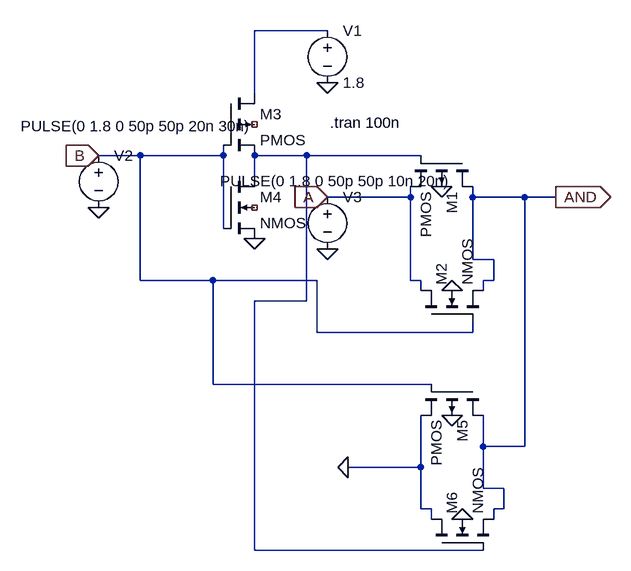
[diagram p0: schematic AND.asc]
AND.asc, the LTspice schematic file:
Version 4.1
SHEET 1 880 712
WIRE 64 -96 -48 -96
WIRE -48 0 -48 -96
WIRE -224 96 -288 96
WIRE -96 96 -96 80
WIRE -96 96 -224 96
WIRE 32 96 -48 96
WIRE 208 96 32 96
WIRE -48 128 -48 96
WIRE 192 160 192 144
WIRE 192 160 64 160
WIRE 288 160 288 144
WIRE 368 160 288 160
WIRE 416 160 368 160
WIRE -96 208 -96 96
WIRE 288 256 288 160
WIRE 320 256 288 256
WIRE -224 288 -224 96
WIRE -112 288 -224 288
WIRE 48 288 -112 288
WIRE 192 288 192 160
WIRE 208 288 192 288
WIRE 320 288 320 256
WIRE 320 288 304 288
WIRE 208 304 208 288
WIRE 304 304 304 288
WIRE 32 320 32 96
WIRE 32 320 -48 320
WIRE 48 368 48 288
WIRE 288 368 288 352
WIRE 288 368 48 368
WIRE -112 448 -112 288
WIRE 224 448 -112 448
WIRE 304 544 304 496
WIRE 368 544 368 160
WIRE 368 544 304 544
WIRE 208 576 208 496
WIRE 208 576 96 576
WIRE 304 608 304 544
WIRE 336 608 304 608
WIRE 208 640 208 576
WIRE 224 640 208 640
WIRE 336 640 336 608
WIRE 336 640 320 640
WIRE 224 656 224 640
WIRE 320 656 320 640
WIRE -48 704 -48 320
WIRE 304 704 -48 704
FLAG 64 -16 0
FLAG 64 160 A
IOPIN 64 160 In
FLAG -48 224 0
FLAG 64 240 0
FLAG -288 176 0
FLAG -288 96 B
IOPIN -288 96 In
FLAG 416 160 AND
IOPIN 416 160 Out
FLAG 240 144 0
FLAG 256 304 0
FLAG 256 496 0
FLAG 272 656 0
FLAG 96 576 0
SYMBOL pmos4 288 96 R90
SYMATTR InstName M1
SYMBOL nmos4 208 352 R270
SYMATTR InstName M2
SYMBOL pmos4 -96 0 R0
SYMATTR InstName M3
SYMBOL nmos4 -96 128 R0
SYMATTR InstName M4
SYMBOL voltage 64 -112 R0
WINDOW 123 0 0 Left 0
WINDOW 39 0 0 Left 0
SYMATTR InstName V1
SYMATTR Value 1.8
SYMBOL voltage -288 80 R0
WINDOW 3 -120 -29 Left 2
WINDOW 123 0 0 Left 0
WINDOW 39 0 0 Left 0
SYMATTR InstName V2
SYMATTR Value PULSE(0 1.8 0 50p 50p 20n 30n)
SYMBOL voltage 64 144 R0
WINDOW 3 -165 -9 Left 2
WINDOW 123 0 0 Left 0
WINDOW 39 0 0 Left 0
SYMATTR InstName V3
SYMATTR Value PULSE(0 1.8 0 50p 50p 10n 20n)
SYMBOL pmos4 304 448 R90
SYMATTR InstName M5
SYMBOL nmos4 224 704 R270
SYMATTR InstName M6
TEXT 68 45 Left 2 !.tran 100n

The netlist it stands for:
* AND.asc
M1 AND N002 A 0 PMOS
M2 A B AND 0 NMOS
M3 N001 B N002 NC_01 PMOS
M4 N002 B 0 NC_02 NMOS
V1 N001 0 1.8
V2 B 0 PULSE(0 1.8 0 50p 50p 20n 30n)
V3 A 0 PULSE(0 1.8 0 50p 50p 10n 20n)
M5 AND B 0 0 PMOS
M6 0 N002 AND 0 NMOS
.model NMOS NMOS
.model PMOS PMOS
.lib standard.mos
.tran 100n
.backanno
.end